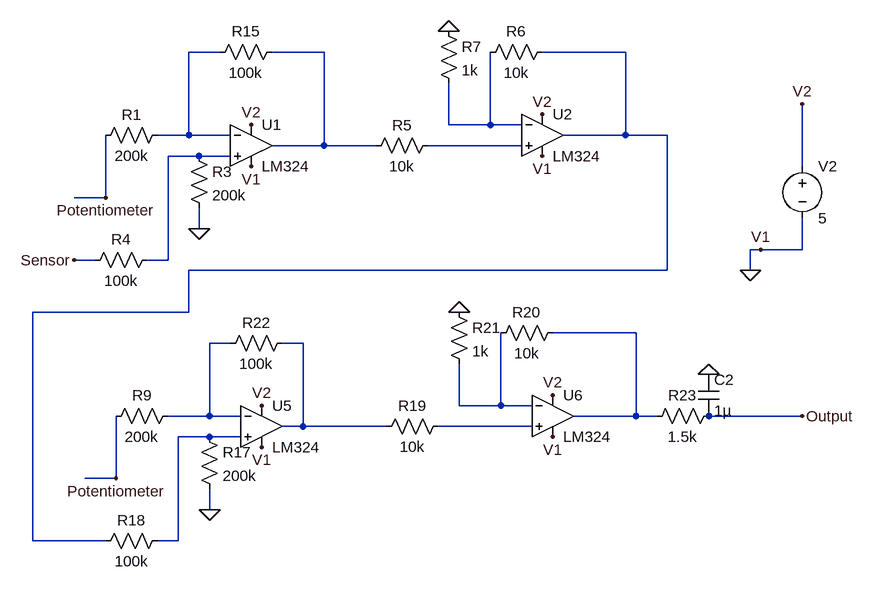
[diagram p0: schematic emt.asc]
emt.asc, the LTspice schematic file:
Version 4
SHEET 1 2920 1172
WIRE 272 -80 224 -80
WIRE 432 -80 352 -80
WIRE 896 -80 768 -80
WIRE 624 32 624 -32
WIRE 688 32 688 -80
WIRE 688 32 624 32
WIRE 736 32 688 32
WIRE 224 48 224 -80
WIRE 224 48 176 48
WIRE 288 48 224 48
WIRE 896 48 896 -80
WIRE 896 48 800 48
WIRE 960 48 896 48
WIRE 432 64 432 -80
WIRE 432 64 352 64
WIRE 512 64 432 64
WIRE 736 64 592 64
WIRE 240 80 192 80
WIRE 288 80 240 80
WIRE 1168 96 1168 0
WIRE 96 144 96 48
WIRE 96 144 48 144
WIRE 240 192 240 160
WIRE 1104 224 1088 224
WIRE 1168 224 1168 176
WIRE 1168 224 1104 224
WIRE 80 240 48 240
WIRE 192 240 192 80
WIRE 192 240 160 240
WIRE 960 256 960 48
WIRE 960 256 224 256
WIRE 1088 256 1088 224
WIRE 224 320 224 256
WIRE 224 320 -16 320
WIRE 912 352 784 352
WIRE 288 368 256 368
WIRE 400 368 368 368
WIRE 640 464 640 400
WIRE 704 464 704 352
WIRE 704 464 640 464
WIRE 752 464 704 464
WIRE 256 480 256 368
WIRE 256 480 192 480
WIRE 304 480 256 480
WIRE 912 480 912 352
WIRE 912 480 816 480
WIRE 944 480 912 480
WIRE 1168 480 1024 480
WIRE 400 496 400 368
WIRE 400 496 368 496
WIRE 528 496 400 496
WIRE 752 496 608 496
WIRE 256 512 208 512
WIRE 304 512 256 512
WIRE 112 576 112 480
WIRE 112 576 64 576
WIRE 256 624 256 592
WIRE -16 672 -16 320
WIRE 96 672 -16 672
WIRE 208 672 208 512
WIRE 208 672 176 672
FLAG 240 192 0
FLAG 96 144 Potentiometer
FLAG 48 240 Sensor
FLAG 768 16 V2
FLAG 768 80 V1
FLAG 624 -112 0
FLAG 320 32 V2
FLAG 320 96 V1
FLAG 256 624 0
FLAG 112 576 Potentiometer
FLAG 784 448 V2
FLAG 784 512 V1
FLAG 640 320 0
FLAG 336 464 V2
FLAG 336 528 V1
FLAG 1024 416 0
FLAG 1168 480 Output
FLAG 1088 256 0
FLAG 1168 0 V2
FLAG 1104 224 V1
SYMBOL Opamps\\opamp2 320 0 R0
SYMATTR InstName U1
SYMATTR Value LM324
SYMBOL res 192 32 R90
WINDOW 0 0 56 VBottom 2
WINDOW 3 32 56 VTop 2
SYMATTR InstName R1
SYMATTR Value 200k
SYMBOL res 224 64 R0
SYMATTR InstName R3
SYMATTR Value 200k
SYMBOL res 176 224 R90
WINDOW 0 0 56 VBottom 2
WINDOW 3 32 56 VTop 2
SYMATTR InstName R4
SYMATTR Value 100k
SYMBOL res 608 48 R90
WINDOW 0 0 56 VBottom 2
WINDOW 3 32 56 VTop 2
SYMATTR InstName R5
SYMATTR Value 10k
SYMBOL Opamps\\opamp2 768 -16 R0
SYMATTR InstName U2
SYMATTR Value LM324
SYMBOL res 784 -96 R90
WINDOW 0 0 56 VBottom 2
WINDOW 3 32 56 VTop 2
SYMATTR InstName R6
SYMATTR Value 10k
SYMBOL res 608 -128 R0
SYMATTR InstName R7
SYMATTR Value 1k
SYMBOL res 368 -96 R90
WINDOW 0 0 56 VBottom 2
WINDOW 3 32 56 VTop 2
SYMATTR InstName R15
SYMATTR Value 100k
SYMBOL Opamps\\opamp2 336 432 R0
SYMATTR InstName U5
SYMATTR Value LM324
SYMBOL res 208 464 R90
WINDOW 0 0 56 VBottom 2
WINDOW 3 32 56 VTop 2
SYMATTR InstName R9
SYMATTR Value 200k
SYMBOL res 240 496 R0
SYMATTR InstName R17
SYMATTR Value 200k
SYMBOL res 192 656 R90
WINDOW 0 0 56 VBottom 2
WINDOW 3 32 56 VTop 2
SYMATTR InstName R18
SYMATTR Value 100k
SYMBOL res 624 480 R90
WINDOW 0 0 56 VBottom 2
WINDOW 3 32 56 VTop 2
SYMATTR InstName R19
SYMATTR Value 10k
SYMBOL Opamps\\opamp2 784 416 R0
SYMATTR InstName U6
SYMATTR Value LM324
SYMBOL res 800 336 R90
WINDOW 0 0 56 VBottom 2
WINDOW 3 32 56 VTop 2
SYMATTR InstName R20
SYMATTR Value 10k
SYMBOL res 624 304 R0
SYMATTR InstName R21
SYMATTR Value 1k
SYMBOL res 384 352 R90
WINDOW 0 0 56 VBottom 2
WINDOW 3 32 56 VTop 2
SYMATTR InstName R22
SYMATTR Value 100k
SYMBOL res 1040 464 R90
WINDOW 0 0 56 VBottom 2
WINDOW 3 32 56 VTop 2
SYMATTR InstName R23
SYMATTR Value 1.5k
SYMBOL cap 1008 416 R0
SYMATTR InstName C2
SYMATTR Value 1µ
SYMBOL voltage 1168 80 R0
WINDOW 123 0 0 Left 0
WINDOW 39 0 0 Left 0
SYMATTR InstName V2
SYMATTR Value 5

The netlist it stands for:
* emt.asc
XU1 N006 N001 V2 0 N002 LM324  ; pins In+ In- V+ V- OUT
R1 N001 Potentiometer 200k
R3 N006 0 200k
R4 N006 Sensor 100k
R5 N005 N002 10k
XU2 N005 N004 V2 0 N003 LM324  ; pins In+ In- V+ V- OUT
R6 N003 N004 10k
R7 0 N004 1k
R15 N002 N001 100k
XU5 N012 N008 V2 0 N009 LM324  ; pins In+ In- V+ V- OUT
R9 N008 Potentiometer 200k
R17 N012 0 200k
R18 N012 N003 100k
R19 N011 N009 10k
XU6 N011 N010 V2 0 N007 LM324  ; pins In+ In- V+ V- OUT
R20 N007 N010 10k
R21 0 N010 1k
R22 N009 N008 100k
R23 Output N007 1.5k
C2 0 Output 1µ
V2 V2 0 5
.backanno
.end